# Altium schematic sheet Power.SchDoc: {Наименование}
size 420 x 297 mm; ApprovedBy: {Утвердил}; CheckedBy: {Проверил}; DrawnBy: {Разраб.}; DocumentNumber: НРДЦ.ХХХХХХ.ХХХ 00; SheetNumber: {}; SheetTotal: {}; Scale: {Мш.}; PageSetup: Record=PageOptions|CenterHorizontal=False|CenterVertical=False|PrintScale=0.95|XCorrection=0.00|YCorrection=0.00|PrintKind=1|BorderSize=5000000|LeftOffset=0|BottomOffset=0|Orientation=1|PaperLength=1000|PaperWidth=1000|Scale=100|PaperSource=15|PrintQuality=600|MediaType=1|DitherType=10|PaperKind=A4|PrintScaleMode=1; ProcessInspection: {Т.контр.}; Mass: {М.}; NormInspection: {Н.контр.}; Letter1Column: {}; Letter2Column: {}; Letter3Column: {}; DocumentType: {Документ}; Rule: PcbType=ProtelPcb
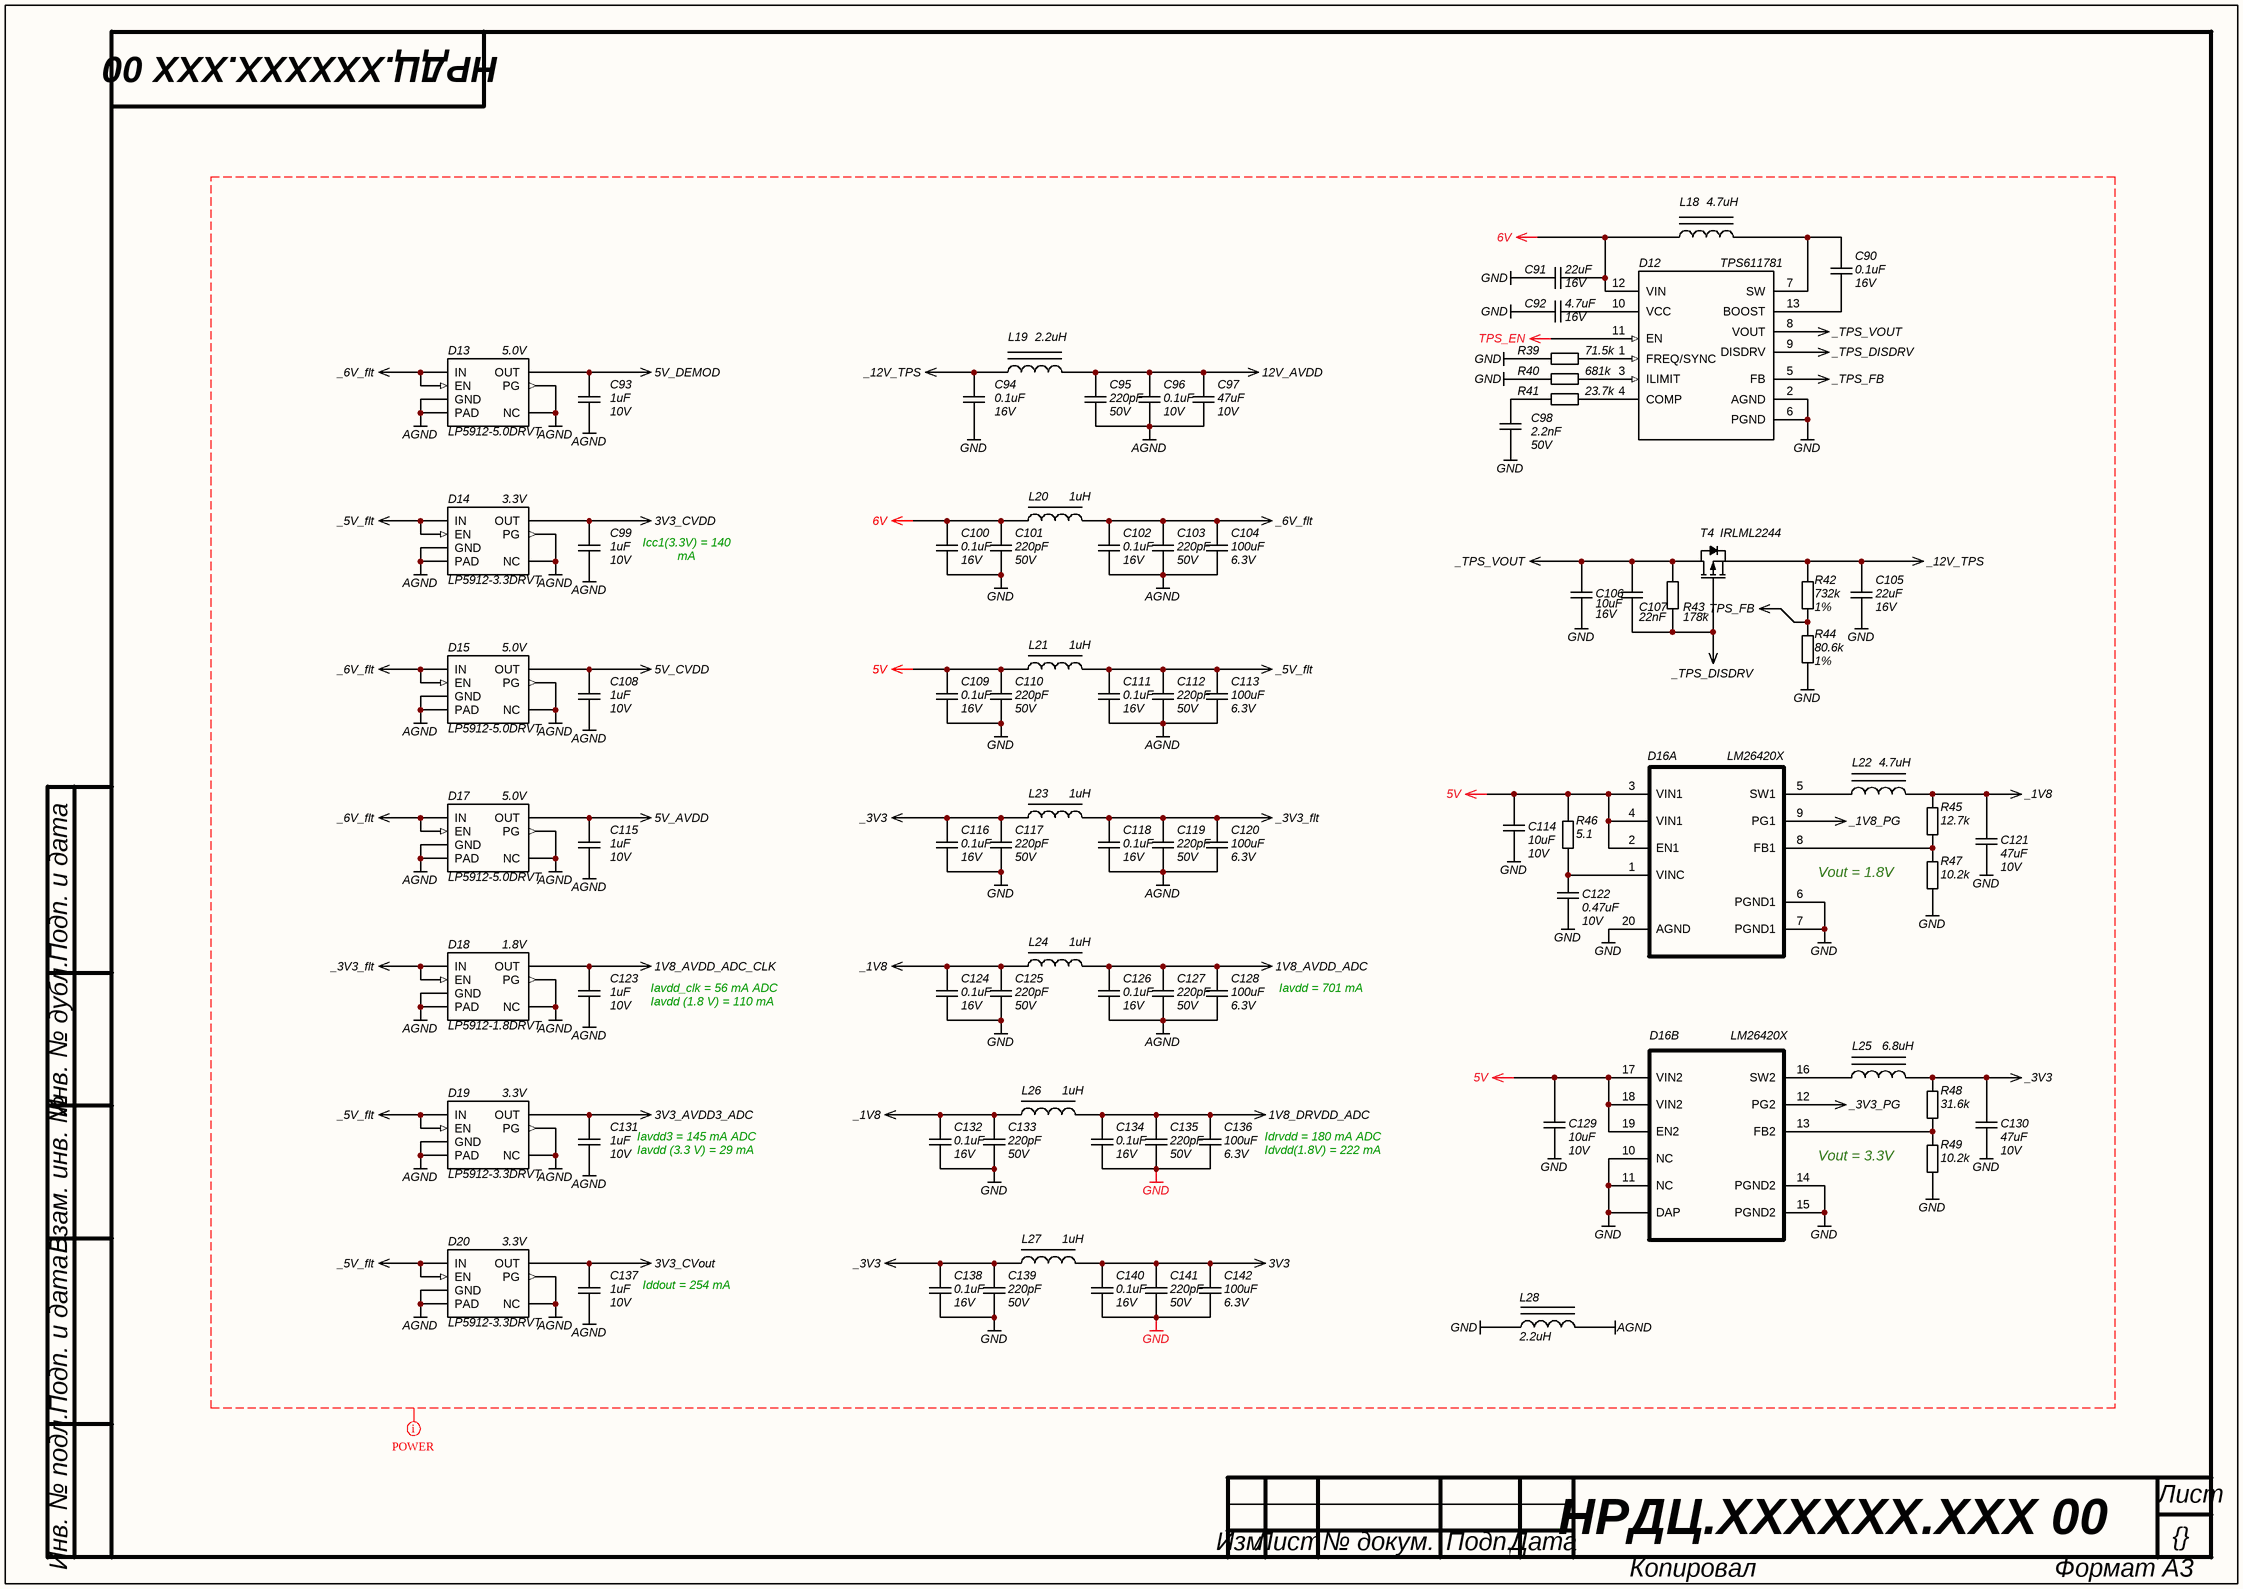
[diagram p0: Power.SchDoc]

## Parts
C90  value 0.1uF  Voltage: 16V  [C0402]  (hidden comment: CAP)
C91  value 22uF  Voltage: 16V  [C0805]  (hidden comment: CAP uF)
C92  value 4.7uF  Voltage: 16V  [C0603]  (hidden comment: CAP)
C93  value 1uF  Voltage: 10V  [C0805]  (hidden comment: CAP)
C94  value 0.1uF  Voltage: 16V  [C0402]  (hidden comment: CAP)
C95  value 220pF  Voltage: 50V  [C0603]  (hidden comment: CAP)
C96  value 0.1uF  Voltage: 10V  [C0402]  (hidden comment: CAP)
C97  value 47uF  Voltage: 10V  [C1210]  (hidden comment: CAP uF)
C98  value 2.2nF  Voltage: 50V  [C0603]  (hidden comment: CAP)
C99  value 1uF  Voltage: 10V  [C0805]  (hidden comment: CAP)
C100  value 0.1uF  Voltage: 16V  [C0603]  (hidden comment: CAP)
C101  value 220pF  Voltage: 50V  [C0603]  (hidden comment: CAP)
C102  value 0.1uF  Voltage: 16V  [C0603]  (hidden comment: CAP)
C103  value 220pF  Voltage: 50V  [C0603]  (hidden comment: CAP)
C104  value 100uF  Voltage: 6.3V  [C1210]  (hidden comment: CAP uF)
C105  value 22uF  Voltage: 16V  [C0805]  (hidden comment: CAP uF)
C106  value 10uF  Voltage: 16V  [C0805]  (hidden comment: CAP uF)
C107  value 22nF  [C0402]  (hidden comment: CAP)
C108  value 1uF  Voltage: 10V  [C0805]  (hidden comment: CAP)
C109  value 0.1uF  Voltage: 16V  [C0603]  (hidden comment: CAP)
C110  value 220pF  Voltage: 50V  [C0603]  (hidden comment: CAP)
C111  value 0.1uF  Voltage: 16V  [C0603]  (hidden comment: CAP)
C112  value 220pF  Voltage: 50V  [C0603]  (hidden comment: CAP)
C113  value 100uF  Voltage: 6.3V  [C1210]  (hidden comment: CAP uF)
C114  value 10uF  Voltage: 10V  [C0805]  (hidden comment: CAP uF)
C115  value 1uF  Voltage: 10V  [C0805]  (hidden comment: CAP)
C116  value 0.1uF  Voltage: 16V  [C0603]  (hidden comment: CAP)
C117  value 220pF  Voltage: 50V  [C0603]  (hidden comment: CAP)
C118  value 0.1uF  Voltage: 16V  [C0603]  (hidden comment: CAP)
C119  value 220pF  Voltage: 50V  [C0603]  (hidden comment: CAP)
C120  value 100uF  Voltage: 6.3V  [C1210]  (hidden comment: CAP uF)
C121  value 47uF  Voltage: 10V  [C1210]  (hidden comment: CAP uF)
C122  value 0.47uF  Voltage: 10V  [C0603]  (hidden comment: CAP)
C123  value 1uF  Voltage: 10V  [C0805]  (hidden comment: CAP)
C124  value 0.1uF  Voltage: 16V  [C0603]  (hidden comment: CAP)
C125  value 220pF  Voltage: 50V  [C0603]  (hidden comment: CAP)
C126  value 0.1uF  Voltage: 16V  [C0603]  (hidden comment: CAP)
C127  value 220pF  Voltage: 50V  [C0603]  (hidden comment: CAP)
C128  value 100uF  Voltage: 6.3V  [C1210]  (hidden comment: CAP uF)
C129  value 10uF  Voltage: 10V  [C0805]  (hidden comment: CAP uF)
C130  value 47uF  Voltage: 10V  [C1210]  (hidden comment: CAP uF)
C131  value 1uF  Voltage: 10V  [C0805]  (hidden comment: CAP)
C132  value 0.1uF  Voltage: 16V  [C0603]  (hidden comment: CAP)
C133  value 220pF  Voltage: 50V  [C0603]  (hidden comment: CAP)
C134  value 0.1uF  Voltage: 16V  [C0603]  (hidden comment: CAP)
C135  value 220pF  Voltage: 50V  [C0603]  (hidden comment: CAP)
C136  value 100uF  Voltage: 6.3V  [C1210]  (hidden comment: CAP uF)
C137  value 1uF  Voltage: 10V  [C0805]  (hidden comment: CAP)
C138  value 0.1uF  Voltage: 16V  [C0603]  (hidden comment: CAP)
C139  value 220pF  Voltage: 50V  [C0603]  (hidden comment: CAP)
C140  value 0.1uF  Voltage: 16V  [C0603]  (hidden comment: CAP)
C141  value 220pF  Voltage: 50V  [C0603]  (hidden comment: CAP)
C142  value 100uF  Voltage: 6.3V  [C1210]  (hidden comment: CAP uF)
D12  TPS611781  [TPS611781x]
D13  Name: LP5912-5.0DRVT  Voltage: 5.0V  [WSON-6]  (hidden comment: LP5912)
D14  Name: LP5912-3.3DRVT  Voltage: 3.3V  [WSON-6]  (hidden comment: LP5912)
D15  Name: LP5912-5.0DRVT  Voltage: 5.0V  [WSON-6]  (hidden comment: LP5912)
D16  LM26420X  [HTSSOP-20]  (parts A,B of 2)
D17  Name: LP5912-5.0DRVT  Voltage: 5.0V  [WSON-6]  (hidden comment: LP5912)
D18  Name: LP5912-1.8DRVT  Voltage: 1.8V  [WSON-6]  (hidden comment: LP5912)
D19  Name: LP5912-3.3DRVT  Voltage: 3.3V  [WSON-6]  (hidden comment: LP5912)
D20  Name: LP5912-3.3DRVT  Voltage: 3.3V  [WSON-6]  (hidden comment: LP5912)
L18  value 4.7uH  [XAL4030]  (hidden comment: Inductor PWR)
L19  value 2.2uH  [XAL4030]  (hidden comment: Inductor PWR)
L20  value 1uH  [L1210_Murata LQH]  (hidden comment: Inductor LF)
L21  value 1uH  [L1210_Murata LQH]  (hidden comment: Inductor LF)
L22  value 4.7uH  [XAL4030]  (hidden comment: Inductor PWR)
L23  value 1uH  [L1210_Murata LQH]  (hidden comment: Inductor LF)
L24  value 1uH  [L1210_Murata LQH]  (hidden comment: Inductor LF)
L25  value 6.8uH  [XAL4030]  (hidden comment: Inductor PWR)
L26  value 1uH  [L1210_Murata LQH]  (hidden comment: Inductor LF)
L27  value 1uH  [L1210_Murata LQH]  (hidden comment: Inductor LF)
L28  value 2.2uH  [XAL4030]  (hidden comment: Inductor PWR)
R39  value 71.5k  [R0402]  (hidden comment: RES)
R40  value 681k  [R0402]  (hidden comment: RES)
R41  value 23.7k  [R0603]  (hidden comment: RES)
R42  value 732k  Tolerance: 1%  [R0402]  (hidden comment: RES)
R43  value 178k  [R0402]  (hidden comment: RES)
R44  value 80.6k  Tolerance: 1%  [R0402]  (hidden comment: RES)
R45  value 12.7k  [R0402]  (hidden comment: RES)
R46  value 5.1  [R0402]  (hidden comment: RES)
R47  value 10.2k  [R0402]  (hidden comment: RES)
R48  value 31.6k  [R0402]  (hidden comment: RES)
R49  value 10.2k  [R0402]  (hidden comment: RES)
T4  IRLML2244  [SOT-23]

## Nets
1V8_AVDD_ADC: C126.2 C127.2 C128.2 L24.2
1V8_AVDD_ADC_CLK: C123.1 D18.1(OUT)
1V8_DRVDD_ADC: C134.2 C135.2 C136.2 L26.2
3V3: C140.2 C141.2 C142.2 L27.2
3V3_AVDD3_ADC: C131.1 D19.1(OUT)
3V3_CVDD: C99.1 D14.1(OUT)
3V3_CVout: C137.1 D20.1(OUT)
5V: C109.2 C110.2 C114.2 C129.2 D16.2(EN1) D16.3(VIN1) D16.4(VIN1) D16.17(VIN2) D16.18(VIN2) D16.19(EN2) L21.1 R46.2
5V_AVDD: C115.1 D17.1(OUT)
5V_CVDD: C108.1 D15.1(OUT)
5V_DEMOD: C93.1 D13.1(OUT)
6V: C91.1 C100.2 C101.2 D12.12(VIN) L18.1 L20.1
12V_AVDD: C95.2 C96.2 C97.2 L19.2
_1V8: C121.2 C124.2 C125.2 C132.2 C133.2 L22.2 L24.1 L26.1 R45.2
_1V8_PG: D16.9(PG1)
_3V3: C116.2 C117.2 C130.2 C138.2 C139.2 L23.1 L25.2 L27.1 R48.2
_3V3_flt: C118.2 C119.2 C120.2 D18.4(EN) D18.6(IN) L23.2
_3V3_PG: D16.12(PG2)
_5V_flt: C111.2 C112.2 C113.2 D14.4(EN) D14.6(IN) D19.4(EN) D19.6(IN) D20.4(EN) D20.6(IN) L21.2
_6V_flt: C102.2 C103.2 C104.2 D13.4(EN) D13.6(IN) D15.4(EN) D15.6(IN) D17.4(EN) D17.6(IN) L20.2
_12V_TPS: C94.2 C105.2 L19.1 R42.2 T4.2(S)
_TPS_DISDRV: C107.2 D12.9(DISDRV) R43.1 T4.1(G)
_TPS_FB: D12.5(FB) R42.1 R44.2
_TPS_VOUT: C106.2 C107.1 D12.8(VOUT) R43.2 T4.3(D)
AGND: C93.2 C95.1 C96.1 C97.1 C99.2 C102.1 C103.1 C104.1 C108.2 C111.1 C112.1 C113.1 C115.2 C118.1 C119.1 C120.1 C123.2 C126.1 C127.1 C128.1 C131.2 C137.2 D13.0(PAD) D13.2(NC) D13.3(PG) D13.5(GND) D14.0(PAD) D14.2(NC) D14.3(PG) D14.5(GND) D15.0(PAD) D15.2(NC) D15.3(PG) D15.5(GND) D17.0(PAD) D17.2(NC) D17.3(PG) D17.5(GND) D18.0(PAD) D18.2(NC) D18.3(PG) D18.5(GND) D19.0(PAD) D19.2(NC) D19.3(PG) D19.5(GND) D20.0(PAD) D20.2(NC) D20.3(PG) D20.5(GND) L28.2
GND: C91.2 C92.2 C94.1 C98.1 C100.1 C101.1 C105.1 C106.1 C109.1 C110.1 C114.1 C116.1 C117.1 C121.1 C122.1 C124.1 C125.1 C129.1 C130.1 C132.1 C133.1 C134.1 C135.1 C136.1 C138.1 C139.1 C140.1 C141.1 C142.1 D12.2(AGND) D12.6(PGND) D16.6(PGND1) D16.7(PGND1) D16.10(NC) D16.11(NC) D16.14(PGND2) D16.15(PGND2) D16.20(AGND) D16.21(DAP) L28.1 R39.1 R40.1 R44.1 R47.1 R49.1
TPS_EN: D12.11(EN)
NetC90_1: C90.1 D12.13(BOOST)
NetC90_2: C90.2 D12.7(SW) L18.2
NetC92_1: C92.1 D12.10(VCC)
NetC98_2: C98.2 R41.1
NetC122_2: C122.2 D16.1(VINC) R46.1
NetD12_1: D12.1(FREQ/SYNC) R39.2
NetD12_3: D12.3(ILIMIT) R40.2
NetD12_4: D12.4(COMP) R41.2
NetD16_5: D16.5(SW1) L22.1
NetD16_8: D16.8(FB1) R45.1 R47.2
NetD16_13: D16.13(FB2) R48.1 R49.2
NetD16_16: D16.16(SW2) L25.1

## Layout directives
net class POWER: 1V8_AVDD_ADC, 1V8_AVDD_ADC_CLK, 1V8_DRVDD_ADC, 3V3, 3V3_AVDD3_ADC, 3V3_CVDD, 3V3_CVout, 5V, 5V_AVDD, 5V_CVDD, 5V_DEMOD, 6V, 12V_AVDD, _1V8, _1V8_PG, _3V3, _3V3_flt, _3V3_PG, _5V_flt, _6V_flt, _12V_TPS, _TPS_DISDRV, _TPS_FB, _TPS_VOUT, AGND, GND, TPS_EN

## Notes on the sheet
- (near C99) Icc1(3.3V) = 140 mA
  Icc2(3.3V) = 130 mA
- Vout = 1.8V
- Iavdd = 701 mA ADC
- Iavdd_clk = 56 mA ADC
  Iavdd (1.8 V) = 110 mA DDS
- (near C131) Iavdd3 = 145 mA ADC
  Iavdd (3.3 V) = 29 mA DDS
- Idrvdd = 180 mA ADC
  Idvdd(1.8V) = 222 mA DDS
- Vout = 3.3V
- (near C137) Iddout = 254 mA
- Подп. и дата
- Инв. № дубл.
- Взам. инв. №
- Инв. № подл.
- Лист
- Изм.
- № докум.
- Подп.
- Дата
- Копировал
- Формат А3

## Library data of the parts
C90 C94 = CAP: SMD Capacitor; Manufacturer: Murata; Material: X5R; Tolerance: ±10%; Type: Ceramic Capacitor; P/N: GRM155R61C104KA88D
C91 C105 = CAP uF: SMD Capacitor; Manufacturer: Murata; Material: X5R; Tolerance: ±20%; Type: Ceramic Capacitor; P/N: GRM21BR61C226ME44L
C92 = CAP: SMD Capacitor; Manufacturer: Murata; Material: X5R; Tolerance: 10%; Type: Ceramic Capacitor; P/N: GRM188R61C475KAAJD
C93 C99 C108 C115 C123 C131 C137 = CAP: SMD Capacitor; Manufacturer: Murata; Material: X7R; Tolerance: 10%; Type: Ceramic Capacitor; P/N: GRM21BR71A105KA01K
C95 C101 C103 C110 C112 C117 C119 C125 C127 C133 C135 C139 C141 = CAP: SMD Capacitor; Manufacturer: Murata; Material: X7R; Tolerance: 10%; Type: Ceramic Capacitor; P/N: GRM188R71H221KA01D
C96 = CAP: SMD Capacitor; Manufacturer: Murata; Material: X7R; Tolerance: 10%; Type: Ceramic Capacitor; P/N: GRM155R71A104KA01J
C97 C121 C130 = CAP uF: SMD Capacitor; Manufacturer: Murata; Material: X7R; Tolerance: 10%; Type: Ceramic Capacitor; P/N: GRM32ER71A476KE15L
C98 = CAP: SMD Capacitor; Manufacturer: Murata; Material: NP0; Tolerance: ±5%; Type: Ceramic Capacitor; P/N: GRM1885C1H222JA01D
C100 C102 C109 C111 C116 C118 C124 C126 C132 C134 C138 C140 = CAP: SMD Capacitor; Manufacturer: Murata; Material: X7R; Tolerance: 10%; Type: Ceramic Capacitor; P/N: GRM188R71C104KA01D
C104 C113 C120 C128 C136 C142 = CAP uF: SMD Capacitor; Manufacturer: Murata; Material: X5R; Tolerance: 20%; Type: Ceramic Capacitor; P/N: GRM32ER60J107ME20L
C106 = CAP uF: SMD Capacitor; Manufacturer: Murata; Material: X5R; Tolerance: ±10%; Type: Ceramic Capacitor; P/N: GRM21BR61C106KE15K
C107 = CAP: SMD Capacitor; Manufacturer: Murata; Material: X7R; Tolerance: 10%; Voltage: 50V; Type: Ceramic Capacitor; P/N: GCM155R71H223KA55D
C114 C129 = CAP uF: SMD Capacitor; Manufacturer: Murata; Material: X5R; Tolerance: 10%; Type: Ceramic Capacitor; P/N: GRM21BR71A106KE51L
C122 = CAP: SMD Capacitor; Manufacturer: Murata; Material: X7R; Tolerance: 10%; Type: Ceramic Capacitor; P/N: GRM188R71A474KA61D
D12 = TPS611781: 10-A Fully-Integrated Synchronous Boost with Load Disconnect Control; Manufacturer: Texas Instruments; Voltage: 4.5 V to 20 V; P/N: TPS611781RNW; Current: 10 A; Name: TPS611781; Package: 13-VQFN-HR (3.5x3.0); Temperature Range: –40°C to 125°C; Type: Synchronous Boost; Supplier 1: Digi-Key; Supplier Part Number 1: 296-46568-1-ND
D13-D15 D17-D20 = LP5912: LP5912 500-mA Low-Noise, Low-IQ LDO; Manufacturer: Texas Instruments; Type: Low-Noise LDO; Current: 500mA; Package: WSON; Temperature Range: –40°C to 125°C
  D13 D15 D17: P/N: LP5912-5.0DRVT; Supplier 1: Arrow Electronics; Supplier Part Number 1: LP5912-5.0DRVT
  D14 D19 D20: P/N: LP5912-3.3DRVT; Supplier 1: Digi-Key; Supplier Part Number 1: 296-44153-2-ND
  D18: P/N: LP5912-1.8DRVT; Supplier 1: Digi-Key; Supplier Part Number 1: 296-44156-6-ND
D16 = LM26420X: Synchronous  DC-DC Converter; Current: 2A; Frequency: 2.2MHz; Input Voltage: 3 V to 5.5 V; Name: LM26420X; Package: HTSSOP 20; Temperature Range: −40°C to + 150°C; Type: Synchronous DC-DC Converter
L18 L22 = Inductor PWR: Magnetic-Core Inductor; Manufacturer: Coilcraft; Name: XEL4030-472ME; Current: 5A; Tolerance: ±20%; P/N: XEL4030-472MEC; Temperature Range: -40ºC to 125ºC
L19 L28 = Inductor PWR: Magnetic-Core Inductor; Manufacturer: Coilcraft; Name: XEL4030-222ME; Current: 5.9A; Tolerance: ±30%; P/N: XEL4030-222MEC; Temperature Range: -40ºC to 125ºC
L20 L21 L23 L24 L26 L27 = Inductor LF: Inductor Power Lines; Manufacturer: Murata; Name: LQH32PN1R0NNC; Current: 2500mA; Tolerance: 5%; Frequency: 100MHz; Temperature Range: -25ºC to 85ºC; Series: LQH; P/N: LQH32PN1R0NNC
L25 = Inductor PWR: Magnetic-Core Inductor; Manufacturer: Coilcraft; Name: XEL4030-682ME; Current: 5A; Tolerance: ±20%; P/N: XEL4030-682MEC; Temperature Range: -40ºC to 125ºC
R39 = RES: SMD Resistor; Manufacturer: Panasonic Electronic Components; Name: Chip SMD Resistor; Power: 0.063 Wt; Tolerance: 1%; P/N: ERJ-2RKF7152X; Temperature Range: -55…155°C
R40 = RES: SMD Resistor; Manufacturer: Panasonic Electronic Components; Name: Chip SMD Resistor; Power: 0.063 Wt; Tolerance: 1%; P/N: ERJ-2RKF6813X; Temperature Range: -55…155°C
R41 = RES: SMD Resistor; Manufacturer: Panasonic Electronic Components; Name: Chip SMD Resistor; Power: 0.1 Wt; Tolerance: 1%; P/N: ERJ-3EKF2372V; Temperature Range: -55…155°C
R42 = RES: SMD Resistor; Manufacturer: Panasonic Electronic Components; Name: Chip SMD Resistor; Power: 0.063 Wt; P/N: ERJ-2RKF7323X; Temperature Range: -55…155°C
R43 = RES: SMD Resistor; Manufacturer: Panasonic Electronic Components; Name: Chip SMD Resistor; Power: 0.063 Wt; Tolerance: 1%; P/N: ERJ-2RKF1783X; Temperature Range: -55…155°C
R44 = RES: SMD Resistor; Manufacturer: Panasonic Electronic Components; Name: Chip SMD Resistor; Power: 0.063 Wt; P/N: ERJ-2RKF8062X; Temperature Range: -55…155°C
R45 = RES: SMD Resistor; Manufacturer: Panasonic Electronic Components; Name: Chip SMD Resistor; Power: 0.062 Wt; Tolerance: 1%; P/N: ERJ-2RKF1272X; Temperature Range: -55…155°C
R46 = RES: SMD Resistor; Manufacturer: Panasonic Electronic Components; Name: Chip SMD Resistor; Power: 0.062 Wt; Tolerance: 5%; P/N: ERJ-2GEJ5R1X; Temperature Range: -55…155°C
R47 R49 = RES: SMD Resistor; Manufacturer: Panasonic Electronic Components; Name: Chip SMD Resistor; Power: 0.062 Wt; Tolerance: 1%; P/N: ERJ-2RKF1022X; Temperature Range: -55…155°C
R48 = RES: SMD Resistor; Manufacturer: Panasonic Electronic Components; Name: Chip SMD Resistor; Power: 0.062 Wt; Tolerance: 1%; P/N: ERJ-2RKF3162X; Temperature Range: -55…155°C
T4 = IRLML2244: P-Channel MOSFET; Current: 4.3A; Channel Resistance: 54 mΩ; Power Dissipation: 1.3W; Voltage: -20V; Name: IRLML2244; Package: SOT-23; Type: P-Channel Mosfet